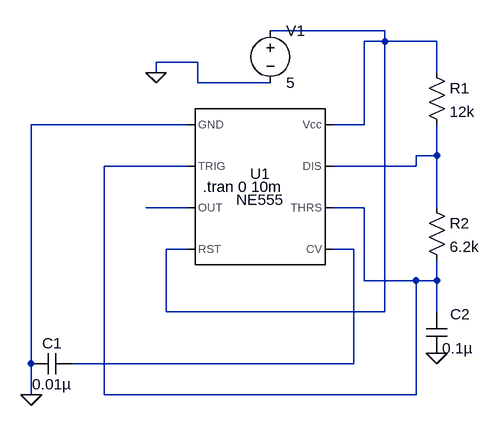
[diagram p0: schematic pcb2.asc]
pcb2.asc, the LTspice schematic file:
Version 4.1
SHEET 1 880 680
WIRE 384 -64 208 -64
WIRE 384 -48 384 -64
WIRE 384 -48 352 -48
WIRE 464 -48 384 -48
WIRE 96 -16 32 -16
WIRE 32 0 32 -16
WIRE 464 0 464 -48
WIRE 96 16 96 -16
WIRE 208 16 96 16
WIRE 80 80 -160 80
WIRE 352 80 352 -48
WIRE 352 80 304 80
WIRE 464 128 464 80
WIRE 464 128 432 128
WIRE 80 144 -48 144
WIRE 432 144 432 128
WIRE 432 144 304 144
WIRE 80 208 16 208
WIRE 352 208 304 208
WIRE 464 208 464 128
WIRE 80 272 48 272
WIRE 336 272 304 272
WIRE 352 320 352 208
WIRE 432 320 352 320
WIRE 464 320 464 288
WIRE 464 320 432 320
WIRE 48 368 48 272
WIRE 384 368 384 -48
WIRE 384 368 48 368
WIRE 464 368 464 320
WIRE -160 448 -160 80
WIRE 336 448 336 272
WIRE 336 448 -96 448
WIRE -160 496 -160 448
WIRE -48 496 -48 144
WIRE 432 496 432 320
WIRE 432 496 -48 496
FLAG -160 496 0
FLAG 464 432 0
FLAG 32 0 0
SYMBOL Misc\\NE555 192 176 R0
SYMATTR InstName U1
SYMBOL cap -160 464 R270
WINDOW 0 32 32 VTop 2
WINDOW 3 0 32 VBottom 2
SYMATTR InstName C1
SYMATTR Value 0.01µ
SYMBOL cap 448 368 R0
WINDOW 0 37 4 Left 2
SYMATTR InstName C2
SYMATTR Value 0.1µ
SYMBOL res 448 -16 R0
SYMATTR InstName R1
SYMATTR Value 12k
SYMBOL res 448 192 R0
SYMATTR InstName R2
SYMATTR Value 6.2k
SYMBOL voltage 208 -80 R0
WINDOW 123 0 0 Left 0
WINDOW 39 0 0 Left 0
SYMATTR InstName V1
SYMATTR Value 5
TEXT 104 176 Left 2 !.tran 0 10m

The netlist it stands for:
* pcb2.asc
X§U1 0 N003 N004 N001 N005 N003 N002 N001 NE555  ; pins GND TRIG OUT RST CV THRS DIS Vcc
C1 0 N005 0.01µ
C2 N003 0 0.1µ
R1 N001 N002 12k
R2 N002 N003 6.2k
V1 N001 0 5
.tran 0 10m
.lib NE555.sub
.backanno
.end